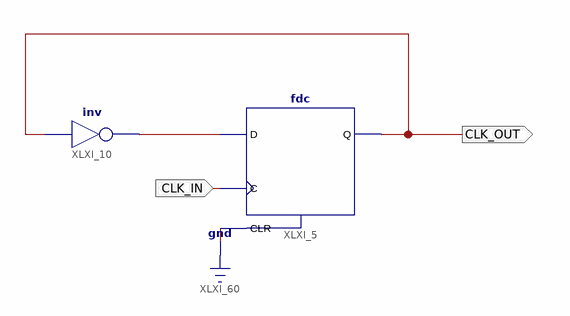
[diagram p0: schematic sheet 1]
// Xilinx ISE schematic Div2.sch (spartan6) as structural Verilog: 2 symbols, 2 ports
module Div2 (
  input  CLK_IN,
  output CLK_OUT
);

  wire XLXN_34;

  fdc XLXI_5 (.C(CLK_IN), .CLR(1'b0), .D(XLXN_34), .Q(CLK_OUT));
  not XLXI_10 (XLXN_34, CLK_OUT);
endmodule
